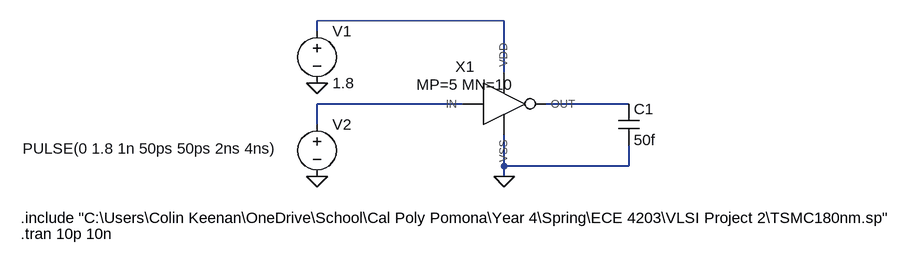
[diagram p0: schematic tutorial.asc]
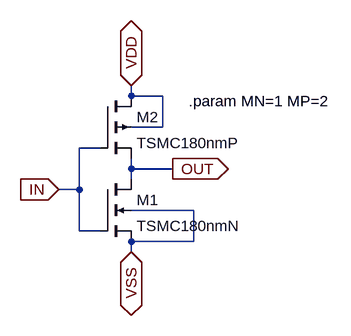
[diagram p1: sub-circuit tutorial_inv.asc]
tutorial.asc, the LTspice schematic file:
Version 4
SHEET 1 1972 1932
WIRE 192 -176 -96 -176
WIRE -96 -160 -96 -176
WIRE 192 -96 192 -176
WIRE 128 -48 -96 -48
WIRE 384 -48 256 -48
WIRE -96 -16 -96 -48
WIRE 192 48 192 0
WIRE 384 48 384 16
WIRE 384 48 192 48
WIRE 192 64 192 48
FLAG -96 -80 0
FLAG -96 64 0
FLAG 192 64 0
SYMBOL tutorial_inv 144 -48 R0
WINDOW 39 -12 -14 Bottom 2
SYMATTR SpiceLine MP=5 MN=10
SYMATTR InstName X1
SYMBOL voltage -96 -176 R0
WINDOW 123 0 0 Left 0
WINDOW 39 0 0 Left 0
SYMATTR InstName V1
SYMATTR Value 1.8
SYMBOL voltage -96 -32 R0
WINDOW 3 -453 53 Left 2
WINDOW 123 0 0 Left 0
WINDOW 39 0 0 Left 0
SYMATTR Value PULSE(0 1.8 1n 50ps 50ps 2ns 4ns)
SYMATTR InstName V2
SYMBOL cap 368 -48 R0
SYMATTR InstName C1
SYMATTR Value 50f
TEXT -552 128 Left 2 !.include "C:\\Users\\Colin Keenan\\OneDrive\\School\\Cal Poly Pomona\\Year 4\\Spring\\ECE 4203\\VLSI Project 2\\TSMC180nm.sp"
TEXT -552 152 Left 2 !.tran 10p 10n

tutorial_inv.asc, the sub-circuit schematic file:
Version 4
SHEET 1 880 680
WIRE 224 -16 224 -32
WIRE 272 -16 224 -16
WIRE 272 32 272 -16
WIRE 272 32 224 32
WIRE 176 64 144 64
WIRE 224 96 224 80
WIRE 288 96 224 96
WIRE 224 112 224 96
WIRE 144 128 144 64
WIRE 144 128 112 128
WIRE 320 160 224 160
WIRE 144 192 144 128
WIRE 176 192 144 192
WIRE 320 208 320 160
WIRE 320 208 224 208
WIRE 224 224 224 208
FLAG 112 128 IN
IOPIN 112 128 In
FLAG 288 96 OUT
IOPIN 288 96 Out
FLAG 224 -32 VDD
IOPIN 224 -32 BiDir
FLAG 224 224 VSS
IOPIN 224 224 BiDir
SYMBOL nmos4 176 112 R0
SYMATTR InstName M1
SYMATTR Value TSMC180nmN
SYMATTR Value2 l=200nm w=300nm m={MN}
SYMBOL pmos4 176 -16 R0
SYMATTR InstName M2
SYMATTR Value TSMC180nmP
SYMATTR Value2 l=200nm w=300nm m={MP}
TEXT 312 -8 Left 2 !.param MN=1 MP=2

The netlist it stands for:
* tutorial.asc
XX1 N002 N003 N001 0 tutorial_inv params: MP=5 MN=10
V1 N001 0 1.8
V2 N002 0 PULSE(0 1.8 1n 50ps 50ps 2ns 4ns)
C1 N003 0 50f

* block symbol definitions
.subckt tutorial_inv IN OUT VDD VSS
M1 OUT IN VSS VSS TSMC180nmN l=200nm w=300nm m={MN}
M2 VDD IN OUT VDD TSMC180nmP l=200nm w=300nm m={MP}
.param MN=1 MP=2
.ends tutorial_inv

.model NMOS NMOS
.model PMOS PMOS
.lib standard.mos
.include "C:\Users\Colin Keenan\OneDrive\School\Cal Poly Pomona\Year 4\Spring\ECE 4203\VLSI Project 2\TSMC180nm.sp"
.tran 10p 10n
.backanno
.end